# Altium schematic sheet core.SchDoc
size A3
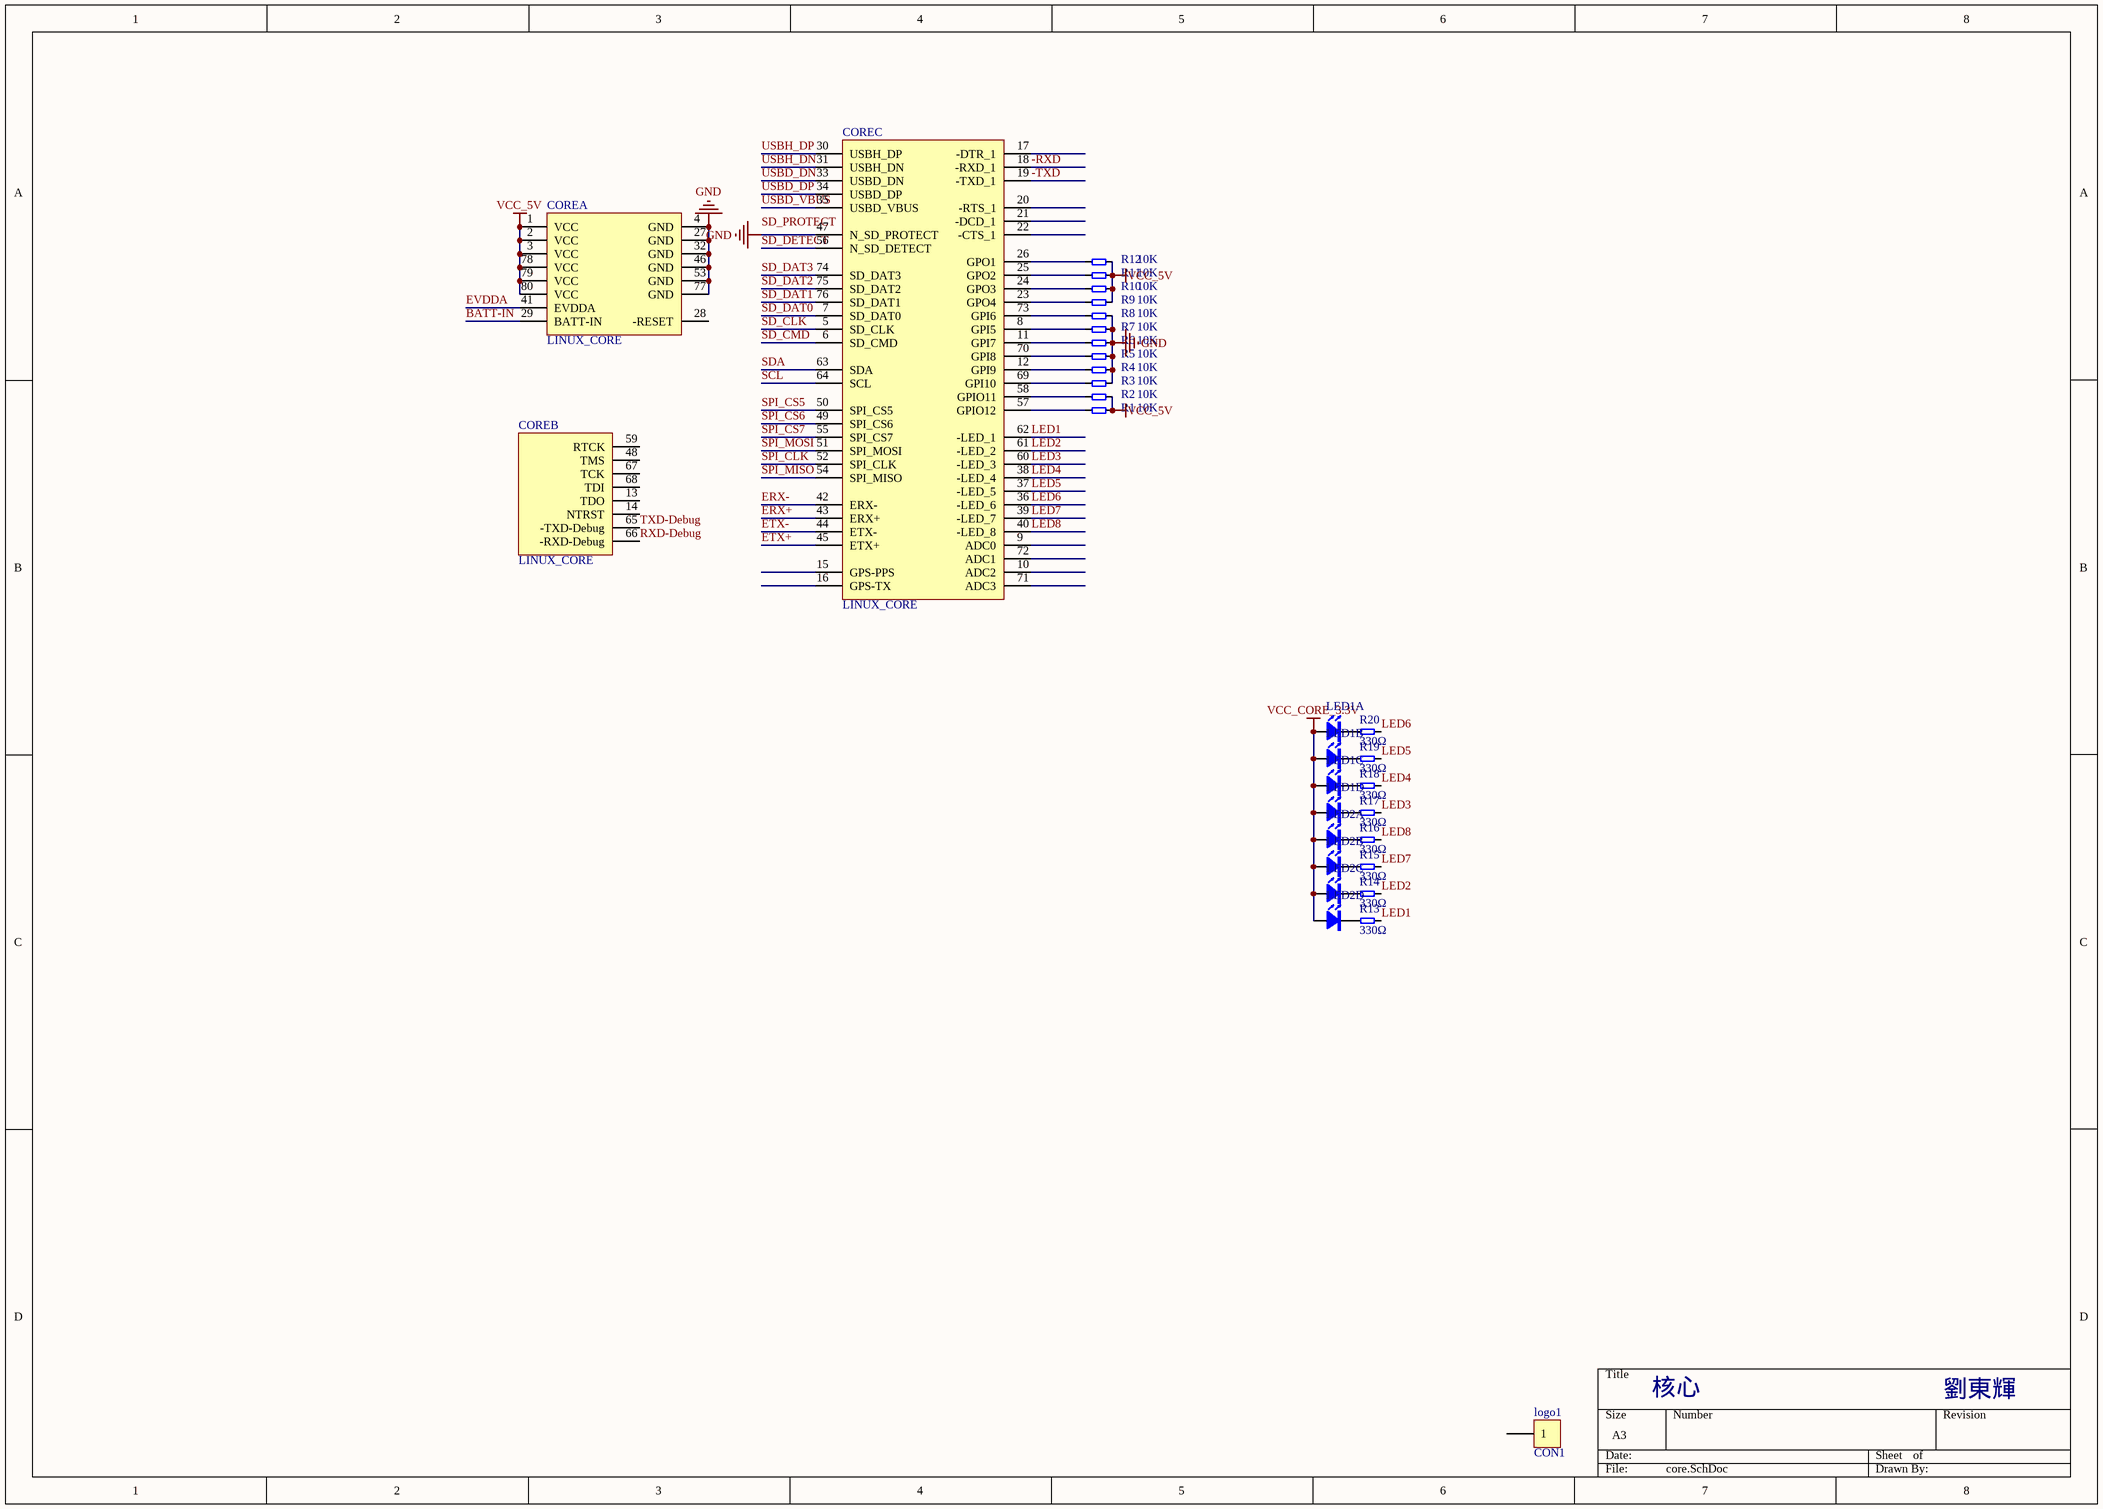
[diagram p0: core.SchDoc]

## Parts
CORE  LINUX_CORE  [LINUX_CORE]  (parts A,B,C of 3)
LED1  (no value)  [3MM-4SYG/S530-Z]  (parts A,B,C,D of 4)
LED2  (no value)  [3MM-4SYG/S530-Z]  (parts A,B,C,D of 4)
logo1  CON1  [LIU]
R1  10K  [0805/2012 R3]
R2  10K  [0805/2012 R3]
R3  10K  [0805/2012 R3]
R4  10K  [0805/2012 R3]
R5  10K  [0805/2012 R3]
R6  10K  [0805/2012 R3]
R7  10K  [0805/2012 R3]
R8  10K  [0805/2012 R3]
R9  10K  [0805/2012 R3]
R10  10K  [0805/2012 R3]
R11  10K  [0805/2012 R3]
R12  10K  [0805/2012 R3]
R13  330Ω  [0805/2012 R3]
R14  330Ω  [0805/2012 R3]
R15  330Ω  [0805/2012 R3]
R16  330Ω  [0805/2012 R3]
R17  330Ω  [0805/2012 R3]
R18  330Ω  [0805/2012 R3]
R19  330Ω  [0805/2012 R3]
R20  330Ω  [0805/2012 R3]

## Nets
GND: CORE.4(GND) CORE.27(GND) CORE.32(GND) CORE.46(GND) CORE.47(N_SD_PROTECT) CORE.53(GND) CORE.77(GND) R3.2 R4.2 R5.2 R6.2 R7.2 R8.2
VCC_5V: CORE.1(VCC) CORE.2(VCC) CORE.3(VCC) CORE.78(VCC) CORE.79(VCC) CORE.80(VCC) R1.2 R2.2 R9.2 R10.2 R11.2 R12.2
VCC_CORE_3.3V: LED1.1(1A) LED1.3(2A) LED1.5(3A) LED1.7(4A) LED2.1(1A) LED2.3(2A) LED2.5(3A) LED2.7(4A)
-RXD: CORE.18(-RXD_1)
-TXD: CORE.19(-TXD_1)
BATT-IN: CORE.29(BATT-IN)
ERX+: CORE.43(ERX+)
ERX-: CORE.42(ERX-)
ETX+: CORE.45(ETX+)
ETX-: CORE.44(ETX-)
EVDDA: CORE.41(EVDDA)
LED1: CORE.62(-LED_1) R13.2
LED2: CORE.61(-LED_2) R14.2
LED3: CORE.60(-LED_3) R17.2
LED4: CORE.38(-LED_4) R18.2
LED5: CORE.37(-LED_5) R19.2
LED6: CORE.36(-LED_6) R20.2
LED7: CORE.39(-LED_7) R15.2
LED8: CORE.40(-LED_8) R16.2
RXD-Debug: CORE.66(-RXD-Debug)
SCL: CORE.64(SCL)
SD_CLK: CORE.5(SD_CLK)
SD_CMD: CORE.6(SD_CMD)
SD_DAT0: CORE.7(SD_DAT0)
SD_DAT1: CORE.76(SD_DAT1)
SD_DAT2: CORE.75(SD_DAT2)
SD_DAT3: CORE.74(SD_DAT3)
SD_DETECT: CORE.56(N_SD_DETECT)
SDA: CORE.63(SDA)
SPI_CLK: CORE.52(SPI_CLK)
SPI_CS5: CORE.50(SPI_CS5)
SPI_CS6: CORE.49(SPI_CS6)
SPI_CS7: CORE.55(SPI_CS7)
SPI_MISO: CORE.54(SPI_MISO)
SPI_MOSI: CORE.51(SPI_MOSI)
TXD-Debug: CORE.65(-TXD-Debug)
USBD_DN: CORE.33(USBD_DN)
USBD_DP: CORE.34(USBD_DP)
USBD_VBUS: CORE.35(USBD_VBUS)
USBH_DN: CORE.31(USBH_DN)
USBH_DP: CORE.30(USBH_DP)
NetCORE_8: CORE.8(GPI5) R7.1
NetCORE_11: CORE.11(GPI7) R6.1
NetCORE_12: CORE.12(GPI9) R4.1
NetCORE_23: CORE.23(GPO4) R9.1
NetCORE_24: CORE.24(GPO3) R10.1
NetCORE_25: CORE.25(GPO2) R11.1
NetCORE_26: CORE.26(GPO1) R12.1
NetCORE_57: CORE.57(GPIO12) R1.1
NetCORE_58: CORE.58(GPIO11) R2.1
NetCORE_69: CORE.69(GPI10) R3.1
NetCORE_70: CORE.70(GPI8) R5.1
NetCORE_73: CORE.73(GPI6) R8.1
NetLED1_2: LED1.2(1K) R20.1
NetLED1_4: LED1.4(2K) R19.1
NetLED1_6: LED1.6(3K) R18.1
NetLED1_8: LED1.8(4K) R17.1
NetLED2_2: LED2.2(1K) R16.1
NetLED2_4: LED2.4(2K) R15.1
NetLED2_6: LED2.6(3K) R14.1
NetLED2_8: LED2.8(4K) R13.1

Not connected (* = marked no-connect by the designer): CORE 9(ADC0) 10(ADC2) 13(TDO) 14(NTRST) 15(GPS-PPS) 16(GPS-TX) 17(-DTR_1) 20(-RTS_1) 21(-DCD_1) 22(-CTS_1) 28(-RESET) 48(TMS) 59(RTCK) 67(TCK) 68(TDI) 71(ADC3) 72(ADC1); logo1 1

## Notes on the sheet
- 核心
- 劉東輝
- Labels drawn without touching a wire or pin: SD_PROTECT

## Library data of the parts
LED1 LED2 = 3MM-4SYG/S530-Z
logo1 = CON1: Connector
R1-R20 = RES2: Resistor